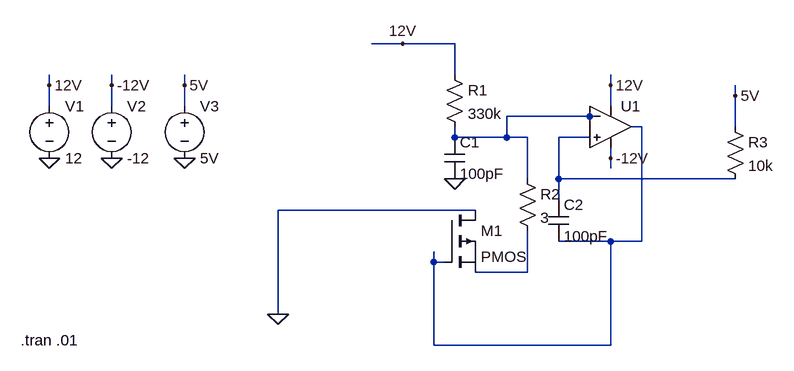
[diagram p0: schematic sawgen.asc]
sawgen.asc, the LTspice schematic file:
Version 4
SHEET 1 1140 680
WIRE 544 -16 496 -16
WIRE 624 -16 544 -16
WIRE 624 32 624 -16
WIRE 0 48 0 32
WIRE 96 48 96 32
WIRE 208 48 208 32
WIRE 864 48 864 32
WIRE 1056 64 1056 48
WIRE 0 80 0 48
WIRE 96 80 96 48
WIRE 208 80 208 48
WIRE 864 80 864 48
WIRE 832 96 704 96
WIRE 848 96 832 96
WIRE 912 112 896 112
WIRE 1056 112 1056 64
WIRE 624 128 624 112
WIRE 704 128 704 96
WIRE 704 128 624 128
WIRE 736 128 704 128
WIRE 832 128 784 128
WIRE 864 160 864 144
WIRE 864 176 864 160
WIRE 736 192 736 128
WIRE 784 192 784 128
WIRE 1056 192 784 192
WIRE 784 224 784 192
WIRE 656 240 352 240
WIRE 864 288 784 288
WIRE 912 288 912 112
WIRE 912 288 864 288
WIRE 592 320 592 304
WIRE 608 320 592 320
WIRE 736 336 736 272
WIRE 736 336 656 336
WIRE 352 400 352 240
WIRE 592 448 592 320
WIRE 864 448 864 288
WIRE 864 448 592 448
FLAG 0 160 0
FLAG 96 160 0
FLAG 208 160 0
FLAG 0 48 12V
FLAG 96 48 -12V
FLAG 208 48 5V
FLAG 624 192 0
FLAG 544 -16 12V
FLAG 864 48 12V
FLAG 864 160 -12V
FLAG 352 400 0
FLAG 1056 64 5V
SYMBOL voltage 0 64 R0
WINDOW 123 0 0 Left 2
WINDOW 39 0 0 Left 2
SYMATTR InstName V1
SYMATTR Value 12
SYMBOL voltage 96 64 R0
WINDOW 123 0 0 Left 2
WINDOW 39 0 0 Left 2
SYMATTR InstName V2
SYMATTR Value -12
SYMBOL voltage 208 64 R0
WINDOW 123 0 0 Left 2
WINDOW 39 0 0 Left 2
SYMATTR InstName V3
SYMATTR Value 5V
SYMBOL cap 608 128 R0
SYMATTR InstName C1
SYMATTR Value 100pF
SYMBOL res 608 16 R0
SYMATTR InstName R1
SYMATTR Value 330k
SYMBOL cap 768 224 R0
SYMATTR InstName C2
SYMATTR Value 100pF
SYMBOL Opamps\\UniversalOpamp2 864 112 R0
SYMATTR InstName U1
SYMATTR Value2 Avol=10Meg GBW=100Meg Slew=100Meg
SYMBOL res 720 176 R0
SYMATTR InstName R2
SYMATTR Value 3
SYMBOL res 1040 96 R0
SYMATTR InstName R3
SYMATTR Value 10k
SYMBOL pmos 608 240 R0
SYMATTR InstName M1
TEXT -44 440 Left 2 !.tran .01

The netlist it stands for:
* sawgen.asc
V1 12V 0 12
V2 -12V 0 -12
V3 5V 0 5V
C1 N001 0 100pF
R1 12V N001 330k
C2 N003 N002 100pF
XU1 N003 N001 12V -12V N002 level.2 Avol=10Meg GBW=100Meg Slew=100Meg ilimit=25m rail=0 Vos=0 phimargin=45 en=0 enk=0 in=0 ink=0 Rin=500Meg  ; pins IN+ IN- V+ V- OUT
R2 N001 N004 3
R3 5V N003 10k
M1 0 N002 N004 N004 PMOS
.model NMOS NMOS
.model PMOS PMOS
.lib standard.mos
.tran .01
.lib UniversalOpamps2.sub
.backanno
.end